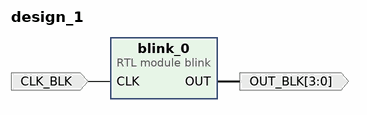
[diagram p0: block diagram of the top level]
# Vivado block design design_1, xc7z020clg400-1, Vivado 2019.2
create_bd_design design_1

create_bd_port -dir I CLK_BLK
create_bd_port -dir O -from 3 -to 0 OUT_BLK

create_bd_cell -type module -reference blink blink_0

# ---- connections ----

connect_bd_net [get_bd_pins blink_0/OUT] [get_bd_ports OUT_BLK]
connect_bd_net [get_bd_ports CLK_BLK] [get_bd_pins blink_0/CLK]

validate_bd_design
save_bd_design
